# EAGLE board radiva3 (EAGLE 7.7.0)
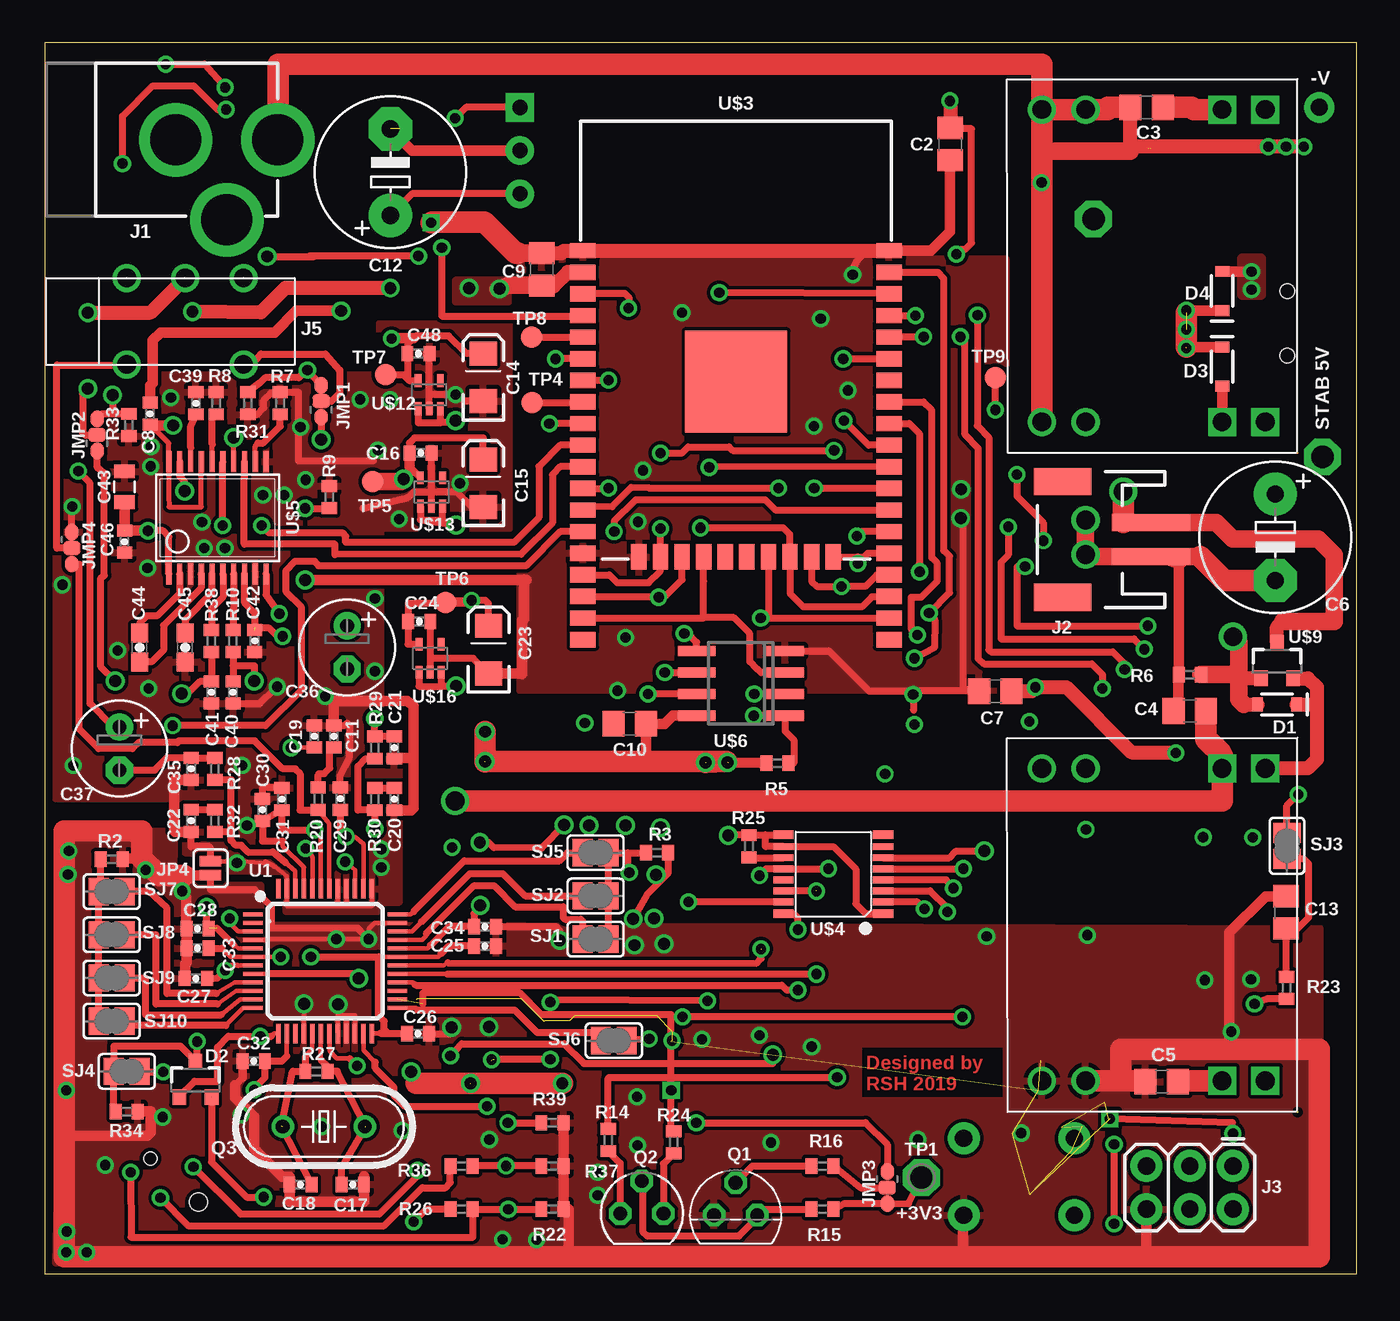
[diagram p2: board, top side]
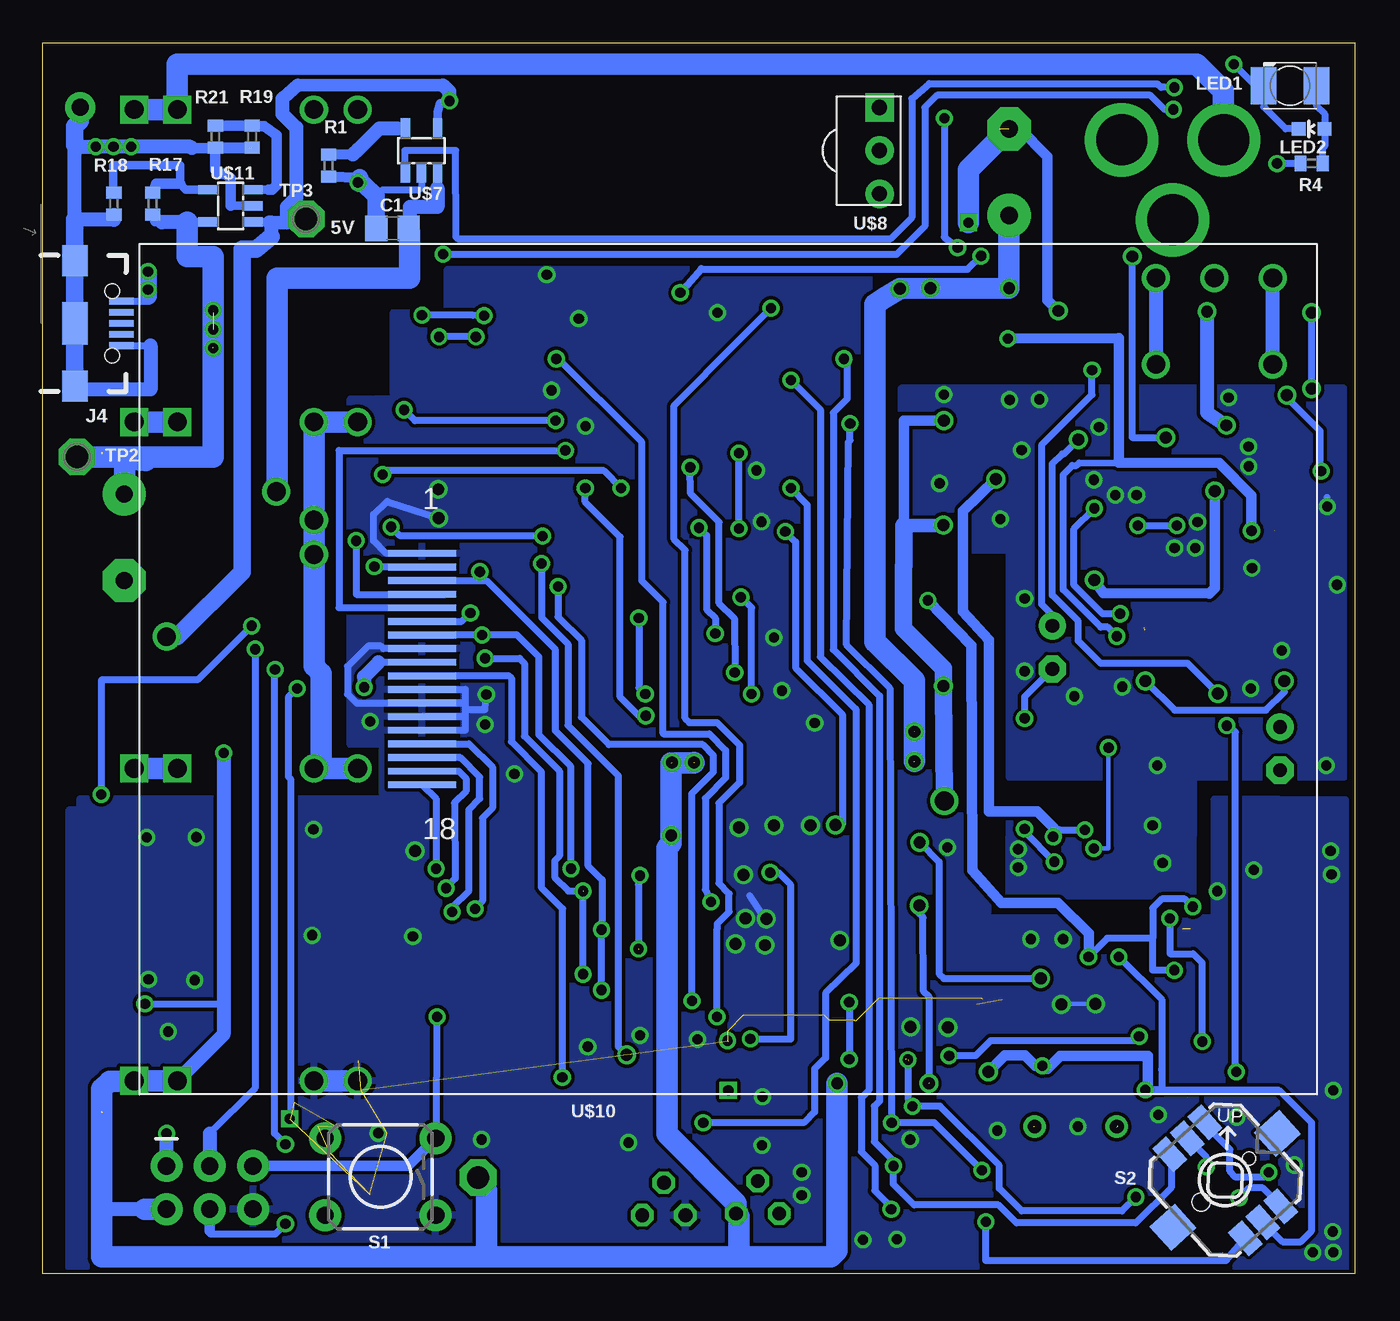
[diagram p3: board, bottom side, seen from below]

Size 77.14 x 72.38 mm. Coordinates in mm from the lower left corner, seen from the top.
Outline: 0,0 77.14,0 77.14,72.38 0,72.38 0,0
Copper layers (1*16): Top 0.035mm / dielectric 1.5mm / Bottom 0.035mm
Design rules "default *": minimum track width 10mil, minimum drill 23mil, track to track 8mil, track to pad 9mil, pad to pad 8mil, via to via 8mil, smd to smd 8mil, copper to edge 10mil, drill to drill 8mil, minimum pad ring 10mil, minimum via ring 8mil, stop-mask expansion 4mil, vias tented up to drill 0mil, thermal gap 10mil
tRestrict: area 48.1,10.4 to 56.3,13.3

## Footprints (pad centres in the part's own frame; a part is rotated, then mirrored left to right if it is on the bottom)
C0805 = smd 1.3 x 1.5: 1 -0.95,0; 2 0.95,0
E5-8,5 = drill 1.016 pad 2.54: + -2.54,0 | drill 1.016 pad 2.54 octagon: - 2.54,0
0402-CAP = smd 0.7 x 0.9: 1 -0.65,0; 2 0.65,0
EIA3216 = smd 1.4 x 1.6: A 1.4,0; C -1.4,0
E2,5-6 = drill 0.813 pad 1.6: + -1.27,0 | drill 0.813 pad 1.6 octagon: - 1.27,0
0805 = smd 0.8 x 1.2: 1 -0.9,0; 2 0.9,0
0603-CAP = smd 1.1 x 1: 1 -0.85,0; 2 0.85,0
SOD-323 = smd 0.63 x 0.83: A 1.15,0; C -1.15,0
SOT23-3 = smd 0.8 x 0.9: 1 -0.95,-1; 2 0.95,-1; 3 0,1.1
POWER_JACK_PTH = drill 2.997 pad 4.318: GND 0,7.7; GNDBREAK 4.7,10.7; PWR 0,13.7
JST-2-SMD = smd 1 x 4.6: 1 -1,-3.7; 2 1,-3.7 | smd 1.6 x 3.4: NC1 -3.4,1.5; NC2 3.4,1.5
2X3 = drill 1.016 pad 1.88: 1 0,0; 2 0,2.54; 3 2.54,0; 4 2.54,2.54; 5 5.08,0; 6 5.08,2.54
USB-B-MICRO-SMD = smd 1.45 x 0.4: D+ 2.725,0; D- 2.725,0.65; GND 2.725,-1.3; ID 2.725,-0.65; VBUS 2.725,1.3 | smd 1.5 x 1.8: SHIELD1 0,3.685; SHIELD2 0,-3.685 | smd 1.5 x 2.5: SHIELD3 0,0 | hole 0.85: 2.2,1.9; 2.2,-1.9
AUDIO-JACK = drill 1.1: P$1 0,0; P$2 0,-3.429; P$3 0,-6.858; P$4 5.08,-6.858; P$5 5.08,0
C0R-JMP = smd 0.8 x 1: 1 0,0.938; 3 0,-0.938 | smd 1 x 0.8: 2 0,0
SJ_2S = smd 0.635 x 1.27: 1 -0.412,0; 2 0.412,0
KA-3528ASYC = smd 1.5 x 2.2: A -1.55,0; C 1.55,0
LED-0603 = smd 0.8 x 0.8: A 0,-0.75; C 0,0.75
TO92 = drill 0.813 octagon: 1 1.27,0; 2 0,1.905; 3 -1.27,0
SOT54E = drill 0.813 octagon: D -1.27,0; G 0,1.905; S 1.27,0
HC49U = drill 0.813: 1 -2.413,0; 2 2.413,0
R0402 = smd 0.7 x 0.9: 1 -0.65,0; 2 0.65,0
TACTILE_SWITCH_PTH_6.0MM = drill 1.016 pad 1.88: 1 -3.251,2.261; 2 3.251,2.261; 3 -3.251,-2.261; 4 3.251,-2.261
JOYSTICK_MINI = smd 1.85 x 1.1: A -3.325,1.4; B 3.325,1.4; C -3.325,-1.4; CTR -3.325,0; D 3.325,-1.4; GND 3.325,0 | smd 1.9 x 2: NC 0,4.13; NC@0 0,-4.13 | hole 0.75: 0,1.9 | hole 1.05: 0,-1.9
SJ = smd 1.168 x 1.6: 1 -0.762,0; 2 0.762,0
P1-13 = drill 1.321 pad 2.159 octagon: TP 0,0
B1,27 = smd 1.27 x 1.27: TP 0,0
LQFP-48 = smd 0.254 x 1.143: 1 -2.75,-4.25; 2 -2.25,-4.25; 3 -1.75,-4.25; 4 -1.25,-4.25; 5 -0.75,-4.25; 6 -0.25,-4.25; 7 0.25,-4.25; 8 0.75,-4.25; 9 1.25,-4.25; 10 1.75,-4.25; 11 2.25,-4.25; 12 2.75,-4.25; 25 2.75,4.25; 26 2.25,4.25; 27 1.75,4.25; 28 1.25,4.25; 29 0.75,4.25; 30 0.25,4.25; 31 -0.25,4.25; 32 -0.75,4.25; 33 -1.25,4.25; 34 -1.75,4.25; 35 -2.25,4.25; 36 -2.75,4.25 | smd 1.143 x 0.254: 13 4.25,-2.75; 14 4.25,-2.25; 15 4.25,-1.75; 16 4.25,-1.25; 17 4.25,-0.75; 18 4.25,-0.25; 19 4.25,0.25; 20 4.25,0.75; 21 4.25,1.25; 22 4.25,1.75; 23 4.25,2.25; 24 4.25,2.75; 37 -4.25,2.75; 38 -4.25,2.25; 39 -4.25,1.75; 40 -4.25,1.25; 41 -4.25,0.75; 42 -4.25,0.25; 43 -4.25,-0.25; 44 -4.25,-0.75; 45 -4.25,-1.25; 46 -4.25,-1.75; 47 -4.25,-2.25; 48 -4.25,-2.75
ESP-WROOM-WROOVER-32 = smd 0.9 x 1.5: 1 7.7,9; 2 6.43,9; 3 5.16,9; 4 3.89,9; 5 2.62,9; 6 1.35,9; 7 0.08,9; 8 -1.19,9; 9 -2.46,9; 10 -3.73,9; 11 -5,9; 12 -6.27,9; 13 -7.54,9; 14 -8.81,9; 25 -8.81,-9; 26 -7.54,-9; 27 -6.27,-9; 28 -5,-9; 29 -3.73,-9; 30 -2.46,-9; 31 -1.19,-9; 32 0.08,-9; 33 1.35,-9; 34 2.62,-9; 35 3.89,-9; 36 5.16,-9; 37 6.43,-9; 38 7.7,-9; 39 -10.08,9; 40 -11.35,9; 41 -12.62,9; 42 -13.89,9; 43 -15.16,9; 44 -15.16,-9; 45 -13.89,-9; 46 -12.62,-9; 47 -11.35,-9; 48 -10.08,-9 | smd 1.5 x 0.9: 15 -10.3,5.715; 16 -10.3,4.445; 17 -10.3,3.175; 18 -10.3,1.905; 19 -10.3,0.635; 20 -10.3,-0.635; 21 -10.3,-1.905; 22 -10.3,-3.175; 23 -10.3,-4.445; 24 -10.3,-5.715 | smd 6 x 6: GND 0,0
TSSOP16-0.65-5X4.4MM = smd 0.5 x 1.2: 1 -2.325,-2.925; 8 2.325,-2.925; 9 2.325,2.925; 16 -2.325,2.925 | smd 0.4 x 1.2: 2 -1.625,-2.925; 3 -0.975,-2.925; 4 -0.325,-2.925; 5 0.325,-2.925; 6 0.975,-2.925; 7 1.625,-2.925; 10 1.625,2.925; 11 0.975,2.925; 12 0.325,2.925; 13 -0.325,2.925; 14 -0.975,2.925; 15 -1.625,2.925
SSOP20 = smd 0.305 x 1.245: 1 -2.857,-3.302; 2 -2.222,-3.302; 3 -1.587,-3.302; 4 -0.952,-3.302; 5 -0.317,-3.302; 6 0.318,-3.302; 7 0.953,-3.302; 8 1.588,-3.302; 9 2.223,-3.302; 10 2.858,-3.302; 11 2.858,3.302; 12 2.223,3.302; 13 1.588,3.302; 14 0.953,3.302; 15 0.318,3.302; 16 -0.317,3.302; 17 -0.952,3.302; 18 -1.587,3.302; 19 -2.222,3.302; 20 -2.857,3.302
SO-08 = smd 0.6 x 2.2: 1 -1.905,-2.6; 2 -0.635,-2.6; 3 0.635,-2.6; 4 1.905,-2.6; 5 1.905,2.6; 6 0.635,2.6; 7 -0.635,2.6; 8 -1.905,2.6
SOT23-5 = smd 0.55 x 1.2: 1 -0.95,-1.3; 2 0,-1.3; 3 0.95,-1.3; 4 0.95,1.3; 5 -0.95,1.3
IR = drill 0.9 pad 1.676 square: P$1 -2.54,0 | drill 0.9 pad 1.676: P$2 0,0; P$3 2.54,0
TFT-DISPLAY-2.8 = smd 4 x 0.4: P$1 -18,6.8; P$2 -18,6; P$3 -18,5.2; P$4 -18,4.4; P$5 -18,3.6; P$6 -18,2.8; P$7 -18,2; P$8 -18,1.2; P$9 -18,0.4; P$10 -18,-0.4; P$11 -18,-1.2; P$12 -18,-2; P$13 -18,-2.8; P$14 -18,-3.6; P$15 -18,-4.4; P$16 -18,-5.2; P$17 -18,-6; P$18 -18,-6.8
SC70 = smd 0.4 x 0.75: 1 -0.65,-0.825; 2 0,-0.825; 3 0.65,-0.825; 4 0.65,0.825; 5 -0.65,0.825
DC-DC_PT1584 = drill 1.1 square: P$1 1.905,-20.193; P$4 1.905,-1.829; P$5 4.445,-20.193; P$8 4.445,-1.829 | drill 1.1: P$2 15.037,-20.193; P$3 15.037,-1.829; P$6 12.471,-20.193; P$7 12.471,-1.829

## Placement (x,y rotation side)
C1  10uF  [C0805]  56.57,61.47 0 bottom
C2  10uF  [C0805]  53.21,66.42 270 top
C3  10uF  [C0805]  64.77,68.58 0 top
C4  10uF  [C0805]  67.31,33.1 0 top
C5  10uF  [C0805]  65.66,11.3 0 top
C6  680uF  [E5-8,5]  72.34,43.31 270 top
C7  10uF  [C0805]  55.88,34.26 0 top
C8  100nF  [0402-CAP]  6.2,50.57 90 top
C9  10uF  [C0805]  29.21,59.05 90 top
C10  10uF  [C0805]  34.39,32.33 180 top
C11  47nF  [0402-CAP]  16.99,31.6 90 top
C12  100uF  [E5-8,5]  20.32,64.77 90 top
C13  10uF  [C0805]  72.97,21.26 270 top
C14  10uF  [EIA3216]  25.78,52.7 90 top
C15  10uF  [EIA3216]  25.78,46.48 90 top
C16  0.1uF  [0402-CAP]  22.1,48.26 0 top
C17  18pF  [0402-CAP]  18.11,5.26 180 top
C18  18pF  [0402-CAP]  15.04,5.26 0 top
C19  0.1uF  [0402-CAP]  15.85,31.6 270 top
C20  10nF  [0402-CAP]  20.55,27.91 270 top
C21  3.3nF  [0402-CAP]  20.55,30.94 270 top
C22  10nF  [0402-CAP]  8.61,26.64 270 top
C23  10uF  [EIA3216]  26.09,36.7 90 top
C24  0.1uF  [0402-CAP]  22.02,38.35 0 top
C25  100nF  [0402-CAP]  25.88,19.28 0 top
C26  100nF  [0402-CAP]  21.95,14.12 0 top
C27  100nF  [0402-CAP]  8.89,17.37 180 top
C28  100nF  [0402-CAP]  8.99,20.29 180 top
C29  100nF  [0402-CAP]  17.37,27.94 90 top
C30  100nF  [0402-CAP]  12.8,27.28 90 top
C31  100nF  [0402-CAP]  13.94,27.91 90 top
C32  100nF  [0402-CAP]  12.29,12.52 180 top
C33  100nF  [0402-CAP]  8.99,19.15 180 top
C34  100nF  [0402-CAP]  25.88,20.42 0 top
C35  3.3nF  [0402-CAP]  8.61,29.69 270 top
C36  220uF  [E2,5-6]  17.78,36.83 270 top
C37  220uF  [E2,5-6]  4.39,30.89 270 top
C39  100nF  [0402-CAP]  8.89,51.18 90 top
C40  2.2nF  [0402-CAP]  11.07,34.19 270 top
C41  2.2nF  [0402-CAP]  9.8,34.19 270 top
C42  100nF  [0402-CAP]  12.34,37.21 270 top
C43  22uF  [0805]  4.7,46.28 90 top
C44  2.2uF  [0603-CAP]  5.59,36.83 90 top
C45  2.2uF  [0603-CAP]  8.26,36.83 90 top
C46  100nF  [0402-CAP]  4.7,43.05 90 top
C48  0.1uF  [0402-CAP]  21.97,54.1 0 top
D1  3A/10V/280mV  [SOD-323]  72.44,33.48 180 top
D2  200mA/70V  [SOT23-3]  8.86,11.4 0 top
D3  3A/10V/280mV  [SOD-323]  69.22,53.34 270 top
D4  3A/10V/280mV  [SOD-323]  69.22,57.78 90 top
J1  POWER_JACK  [POWER_JACK_PTH]  0,66.67 270 top
J2  [JST-2-SMD]  61.34,43.18 90 top
J3  [2X3]  69.85,6.35 180 top
J4  [USB-B-MICRO-SMD]  75.23,55.88 0 bottom
J5  AUDIO-JACK  [AUDIO-JACK]  11.68,58.55 270 top
JMP1  0R-JUMPC  [C0R-JMP]  16.26,51.31 180 top
JMP2  0R-JUMPC  [C0R-JMP]  3.07,49.33 180 top
JMP3  0R-JUMPC  [C0R-JMP]  49.53,5.08 0 top
JMP4  0R-JUMPC  [C0R-JMP]  1.6,42.67 0 top
JP4  [SJ_2S]  9.75,23.85 90 top
LED1  3528  [KA-3528ASYC]  3.81,69.85 180 bottom
LED2  0603  [LED-0603]  2.54,67.31 90 bottom
Q1  2N3904  [TO92]  40.61,3.45 0 top
Q2  BS250  [SOT54E]  35.1,3.56 0 top
Q3  12.288MHz  [HC49U]  16.41,8.66 0 top
R1  1.1k  [R0402]  60.33,65.15 90 bottom
R2  100k  [R0402]  3.94,24.38 180 top
R3  100k  [R0402]  35.99,24.77 180 top
R4  2k  [R0402]  2.54,65.28 180 bottom
R5  10k  [R0402]  43.08,30.02 0 top
R6  10k  [R0402]  67.31,35.23 180 top
R7  10k  [R0402]  13.84,51.18 90 top
R8  10k  [R0402]  10.08,51.18 90 top
R9  10k  [R0402]  16.74,45.67 270 top
R10  470  [R0402]  11.07,37.21 90 top
R14  10  [R0402]  33.12,7.87 90 top
R15  10k  [R0402]  45.72,3.81 180 top
R16  1k  [R0402]  45.72,6.35 180 top
R17  100k  [R0402]  70.66,62.92 90 bottom
R18  100k  [R0402]  72.95,62.92 270 bottom
R19  6.8k  [R0402]  64.82,66.85 90 bottom
R20  10  [R0402]  16.08,27.94 270 top
R21  6.8k  [R0402]  66.98,66.85 90 bottom
R22  10k  [R0402]  29.84,3.81 0 top
R23  10k  [R0402]  73,16.81 90 top
R24  100k  [R0402]  36.98,7.75 270 top
R25  10k  [R0402]  41.4,25.15 270 top
R26  10k  [R0402]  24.51,3.81 0 top
R27  1M  [R0402]  15.98,11.91 0 top
R28  470  [R0402]  10.01,29.69 270 top
R29  470  [R0402]  19.41,30.94 270 top
R30  20  [R0402]  19.41,27.91 270 top
R31  47k  [R0402]  11.94,51.18 270 top
R32  20  [R0402]  10.01,26.64 270 top
R33  47k  [R0402]  4.95,49.91 90 top
R34  1k  [R0402]  4.83,9.55 180 top
R36  10k  [R0402]  24.51,6.35 0 top
R37  10k  [R0402]  29.84,6.35 180 top
R38  470  [R0402]  9.8,37.21 90 top
R39  10k  [R0402]  29.84,8.89 0 top
S1  MOMENTARY-SWITCH-SPST-PTH-6.0MM  [TACTILE_SWITCH_PTH_6.0MM]  57.28,5.71 180 bottom
S2  [JOYSTICK_MINI]  7.62,5.51 312 bottom
SJ1  [SJ]  32.38,19.68 0 top
SJ2  [SJ]  32.38,22.23 0 top
SJ3  [SJ]  73.03,25.17 270 top
SJ4  [SJ]  4.83,11.91 180 top
SJ5  [SJ]  32.38,24.77 0 top
SJ6  [SJ]  33.45,13.72 0 top
SJ7  [SJ]  3.94,22.48 0 top
SJ8  [SJ]  3.94,19.94 0 top
SJ9  [SJ]  3.94,17.4 0 top
SJ10  [SJ]  3.94,14.86 0 top
TP1  PTR1PAD1-13  [P1-13]  51.54,5.66 0 top
TP2  PTR1PAD1-13  [P1-13]  75.11,48.03 90 bottom
TP3  PTR1PAD1-13  [P1-13]  61.65,62.03 0 bottom
TP4  PTR1B1,27  [B1,27]  28.65,51.23 180 top
TP5  PTR1B1,27  [B1,27]  19.28,46.58 0 top
TP6  PTR1B1,27  [B1,27]  23.57,39.47 0 top
TP7  PTR1B1,27  [B1,27]  20.04,52.86 0 top
TP8  PTR1B1,27  [B1,27]  28.63,55.07 180 top
TP9  PTR1B1,27  [B1,27]  55.88,52.7 0 top
U1  VS1053B  [LQFP-48]  16.48,18.39 270 top
U$3  ESP-WROOM-WROOVER-32  [ESP-WROOM-WROOVER-32]  40.64,52.45 90 top
U$4  XPT2046  [TSSOP16-0.65-5X4.4MM]  46.35,23.5 90 top
U$5  PCM510X  [SSOP20]  10.16,44.45 0 top
U$6  IPS6404L-SQ-SPN  [SO-08]  40.92,34.72 90 top
U$7  TP4054  [SOT23-5]  54.86,66.04 0 bottom
U$8  VS1838  [IR]  27.94,66.04 270 bottom
U$9  CJ2301  [SOT23-3]  72.44,36.02 0 top
U$10  TFT-DISPLAY-2.8  [TFT-DISPLAY-2.8]  36.83,35.56 0 bottom
U$11  SY6280  [SOT23-5]  66.09,62.79 90 bottom
U$12  3.2  [SC70]  22.61,51.69 0 top
U$13  2.8  [SC70]  22.73,45.97 0 top
U$14  3.3V 2A  [DC-DC_PT1584]  73.66,9.53 180 top
U$15  5V 2A  [DC-DC_PT1584]  73.66,48.26 180 top
U$16  1.8  [SC70]  22.66,36.2 0 top

## Tracks (layer width: path | path; a pad name or v marks a point on that pad's centre or on a via)
0  (via drill 0.6)
  Top 0.406: U$3.25 48.01,43.64 v47.75,43.38 | v56.64,43.92 56.64,42.27 56.21,41.83 56.21,37.34 64.03,37.34 v64.64,36.73
  Bottom 0.406: v47.75,43.38 56.11,43.38 v56.64,43.92 | v64.64,36.73 64.64,10.92 67.31,8.26
  Bottom 0.813: 67.31,8.26 J3.3
2  (via drill 0.6, 0.7)
  Top 0.254: 13.34,13.97 13.51,14.14 U1.13 13.49,14.15 13.31,13.97 v12.68,13.97
  Top 0.406: U$3.48 48.39,42.37 48.17,42.15 U$3.24 47.8,42.15 v47.8,41.76 | D2.1 7.92,10.43 8.81,11.33 10.16,11.33 10.16,13.34 10.79,13.97 v12.68,13.97 13.34,13.97 | v23.85,12.83 24.51,13.54 30.53,13.54 31.7,12.37 42.8,12.37 v42.8,12.88
  Bottom 0.406: v47.8,41.76 47.8,38.58 46.25,37.03 46.25,32.26 43.28,29.29 43.28,13.36 v42.8,12.88 | v12.68,13.97 12.93,13.72 21.41,13.72 22.3,12.83 v23.85,12.83
4  (via drill 0.6, 0.7)
  Top 0.254: 13.16,17.63 13.14,17.64 U1.8
  Top 0.406: 30.56,26.39 v30.53,26.39 29.21,25.04 26.39,25.07 26.09,25.38 v25.58,25.38 | v18.47,17.37 18.21,17.63 13.16,17.63 | v33.48,43.64 33.48,44.25 34.75,45.52 42.34,45.52 42.95,44.91 U$3.26
  Bottom 0.406: v25.58,25.38 24.43,24.23 24.43,17.65 24.16,17.37 v18.47,17.37 | v33.48,43.64 32.87,43.03 32.87,35.64 30.12,32.89 30.12,26.42 30.15,26.39 v30.53,26.39
5  (via drill 0.6)
  Top 0.406: U$3.29 48.43,48.72 v46.99,50.16 | v55.88,50.8 TP9.TP
  Bottom 0.406: v46.99,50.16 55.24,50.16 v55.88,50.8
5V  (via drill 0.6, 1.1)
  Top 0.406: v4.57,65.28 4.57,68.07 6.35,69.85 8.76,69.85 10.16,68.45 v10.67,68.45 | C2.1 53.27,67.31 54.48,67.31 54.48,60.6 54.1,60.22 53.87,60.22 v53.59,59.94
  Top 0.813: 53.27,67.31 53.27,68.9 v53.21,68.96 | 70.48,33.48 D1.A | U$9.1 70.25,35.02 70.18,34.95
  Top 1.016: v69.85,37.47 69.88,37.47 70.18,37.16 70.18,35.56 | 70.18,35.56 70.18,34.95 70.18,33.78 70.48,33.48 | R6.1 69.85,35.23 70.18,35.56
  Bottom 0.406: R4.2 v4.57,65.28 | v10.67,68.45 11.18,68.45 12.01,69.29 24.56,69.29 25.27,68.58 25.27,61.59 26.92,59.94 v53.59,59.94
  Bottom 0.508: U$7.4 53.91,68.16 53.92,68.17 53.92,68.3 53.77,68.83 53.34,68.83 v53.21,68.96 | 63.8,61.82 63.82,61.84 U$11.1 63.72,61.84 63.7,61.82
  Bottom 0.762: 62.97,69.14 62.13,69.9 53.59,69.88
  Bottom 0.813: 63.8,61.82 63.78,61.82 62.78,61.81 | 62.78,61.81 62.61,61.98 | 53.59,69.88 53.24,69.52 53.24,68.99 v53.21,68.96 | TP3.TP 62.53,62.03 62.78,61.81 | 62.97,69.14 63.04,69.06 63.04,68.2 62.23,67.39 62.23,63.27 62.78,62.73 62.78,61.81 | 63.7,61.82 63.7,60.98
  Bottom 1.016: 63.7,60.98 64.59,60.25 65.41,60.25 65.41,41.27 69.22,37.47 v69.85,37.47
12  (via drill 0.6)
  Top 0.406: SJ4.1 5.61,11.89 v6.96,11.89 | U$3.14 30.31,43.64 28.3,41.63 16.08,41.63 16.08,41.68 15.88,41.88 14.71,41.88 14.17,41.33 14.17,40.13 15.06,39.24 15.06,34.29 12.98,32.23 v7.52,32.23
  Bottom 0.406: v6.96,11.89 7.01,11.94 7.01,31.85 7.39,32.23 v7.52,32.23
13  (via drill 0.6)
  Top 0.406: U$3.40 33.19,41.1 33.66,40.64 35.51,40.64 36.2,41.33 U$3.16 v36.2,43.81 | v36.2,48.26 37.47,48.26 37.82,48.62 40.23,48.62 40.44,48.41 v46.41,48.41
  Bottom 0.406: U$10.P$5 59.72,39.16 59.72,48.41 v46.41,48.41 | v36.2,43.81 v36.2,48.26
14  (via drill 0.6)
  Top 0.406: v43.13,46.2 35.51,46.21 34.47,46.23 33.35,45.11 31.81,45.09 U$3.13 | v57.15,46.99 57.15,45.72 58.7,44.17 v58.7,43.1
  Bottom 0.305: 53.44,39.95 53.47,39.93 54.8,39.93 U$10.P$4
  Bottom 0.406: v58.7,43.1 58.7,39.95 53.44,39.95 | v43.13,46.2 44.15,47.22 57.15,47.22 v57.15,46.99
15  (via drill 0.6)  (3 unrouted)
  Top 0.254: 19.43,12.45 18.73,13.14 U1.23
  Top 0.406: U$3.23 45.09,40.72 45.39,40.41 v46.84,40.41 48.23,40.41 48.92,41.1 U$3.47 | 19.43,12.45 19.43,12.09 20.52,11 20.52,10.52 21.16,9.86 v26.01,9.86 | v38.96,16.05 29.74,16.1 v29.72,15.98 | v29.72,12.62 26.42,12.62 | 9.75,10.46 9.8,10.41 9.8,6.58 11.86,4.52 v12.88,4.52
  Bottom 0.406: v46.84,40.41 46.84,38.63 45.47,37.26 45.47,32.74 43.84,31.11 38.33,31.11 37.72,30.5 37.72,29.49 38.99,28.22 38.99,16.08 v38.96,16.05 38.99,16.1 | v29.72,15.98 v29.72,12.62 | 26.36,12.62 26.24,12.52 26.24,10.24 26.01,9.88 v26.01,9.86 24.38,9.86 20.9,6.38 20.9,5.03 19.58,3.71 13.69,3.71 v12.88,4.52
  other vias: 26.26,12.6
16  (via drill 0.6)
  Top 0.406: v41.68,32.82 U$6.1 43.52,31.92 44.04,31.39 44.04,30.04 R5.2 | v45.24,46.2 49.62,46.2 U$3.27
  Bottom 0.406: v41.68,32.82 41.71,32.84 42.11,32.84 43.18,33.91 43.18,43.33 45.24,45.39 v45.24,46.2
17  (via drill 0.6)
  Top 0.406: U$3.28 39.12,47.43 v39.06,47.42 | v36.45,35.36 U$6.6
  Bottom 0.406: v36.45,35.36 36.47,38.53 37.36,39.42 37.36,44.2 39.04,45.87 v39.06,47.42
18  (via drill 0.6)
  Top 0.254: U1.28 21.65,17.14 21.77,17.02
  Top 0.406: 43.43,21.16 U$4.16 43.47,21.13 44.07,21.13 44.27,20.93 v44.27,20.24 | U$3.30 50.82,49.99 51.41,49.4 51.41,41.76 v51.44,41.27 | 21.77,17.02 21.82,16.97 43.33,16.97 43.61,16.69 v44.27,16.69
  Bottom 0.406: v44.27,16.69 v44.27,20.24 44.25,20.27 44.25,23.16 45.06,23.98 45.06,30 46.99,31.93 46.99,36.7 51.05,40.76 51.44,40.76 | U$10.P$3 51.44,40.76 | v51.44,41.27 51.44,40.76
19  (via drill 0.6)  (1 unrouted)
  Top 0.254: U1.30 23.45,18.14 23.7,18.29
  Top 0.406: U$3.31 51.66,51.26 52.15,50.77 52.15,42.11 52.48,41.78 52.48,40.74 51.51,39.78 50.93,39.78 50.93,37.92 v51.31,37.57 | v46.08,23.82 v46.07,23.82 U$4.12 42.41,23.82 v42.01,23.42 | 23.7,18.29 41.83,18.26 42.11,18.54 v42.11,19.1
  Bottom 0.406: U$10.P$7 v51.31,37.57 49.25,37.57 47.95,36.27 47.95,31.7 46.08,29.82 v46.08,23.82 | v42.01,23.42 42.01,23.39 42.11,22.89 42.11,19.07
21  (via drill 0.6)
  Top 0.406: U$4.15 v37.85,21.87 | v46.94,53.8 U$3.33
  Bottom 0.406: 37.87,21.87 v37.85,21.87 38.15,22.58 38.18,22.61 38.18,27.96 36.98,29.16 36.98,30.79 37.95,31.75 40.64,31.75 40.66,31.77 40.66,39.5 41.91,40.74 41.91,48.9 46.94,53.92 v46.94,53.8
22  (via drill 0.6, 0.7)
  Top 0.305: U$5.14 11.11,48.7 11.1,48.72
  Top 0.406: U$3.36 49.62,57.63 v39.65,57.68 | v21.97,59.84 15.88,59.84 | 15.88,59.84 15.57,59.84 15.54,59.82 | 11.1,48.72 v11.1,49.17 | v13.08,59.82 15.85,59.82 15.88,59.84
  Bottom 0.406: v39.65,57.68 38.41,59.11 38.35,59.05 22.76,59.05 v21.97,59.84 | 11.1,49.12 v11.1,49.17 13.08,49.17 v13.08,59.82
23  (via drill 0.6)  (1 unrouted)
  Top 0.254: U1.29 21.38,17.64 23.67,17.63
  Top 0.406: 45.34,22.5 43.45,22.5 U$4.14 | U$3.37 52.5,58.88 52.86,58.52 52.86,42.52 53.19,42.19 53.19,40.06 v51.99,38.86 52.32,38.46 52.3,36.8 v51.13,36.2 | 23.67,17.63 v45.36,17.63
  Bottom 0.406: v45.36,17.63 v45.36,22.5 46.23,22.5 47.04,23.32 47.04,24.28 46.76,24.56 46.76,29.57 48.82,31.62 48.82,35.89 49.1,36.2 v51.13,36.2 | U$10.P$6 52.5,38.36 v51.99,38.86
25  (via drill 0.6)
  Top 0.406: U$3.10 30.31,48.72 29.06,47.47 29.06,44.48 27.58,43 17.7,43 17.7,43.36 17.5,43.56 13.18,43.56 v12.75,43.99 | v10.46,43.99 10.46,47.74 U$5.15
  Bottom 0.406: v12.75,43.99 v10.46,43.99
26
  Top 0.406: U$3.11 30.31,47.45 29.84,46.99 29.84,44.15 28.02,42.32 17.07,42.29 17.07,42.9 11.73,42.9 11.73,46.81 11.75,46.81 U$5.13
27  (via drill 0.6)
  Top 0.406: U$3.12 33.15,46.18 v33.15,46.2 | v38.3,8.89 48.26,8.89 49.53,7.62 JMP3.1
  Bottom 0.406: v38.3,8.89 32.38,8.89 31.75,9.53 31.75,12.06 31.11,12.7 31.11,16.51 29.31,18.26 29.34,33.22 29.36,33.22 32.18,36.04 32.18,45.21 v33.15,46.2
32
  Top 0.406: TP4.TP 31.61,51.23 U$3.8
33  (via drill 0.6)
  Top 0.406: v8.74,6.3 11.51,3.53 19.68,3.53 21.92,5.77 v21.92,6.1 | v27.23,8.89 R39.1 | U$3.9 v29.67,49.99
  Bottom 0.406: S2.CTR 8.74,6.88 v8.74,6.3 | v21.92,6.1 24.71,8.89 v27.23,8.89 27.33,34.44 29.87,36.98 29.77,48.9 29.67,49 v29.67,49.99
34  (via drill 0.6)
  Top 0.406: R36.2 v27.13,6.35 R37.2 | U$3.6 v30.02,53.8
  Bottom 0.406: S2.C 10.88,6.97 10.79,6.88 10.79,5.08 12.88,3 19.89,3 20.95,4.06 25.91,4.06 27.13,5.28 v27.13,6.35 27.13,6.66 28.25,7.77 28.25,9.86 27.94,10.16 27.94,33.98 30.66,36.7 30.66,50.62 29.84,51.44 29.84,53.62 v30.02,53.8
35  (via drill 0.6)
  Top 0.406: v5.05,5.97 5.08,2.16 25.17,2.16 R26.2 | R26.2 | U$3.7 31.66,52.55 v33.15,52.55 | R22.1 v27.25,3.81 R26.2
  Bottom 0.406: v5.05,5.97 5.33,5.69 7.01,5.69 7.34,6.04 7.34,7.32 8.8,8.8 S2.A | v33.15,52.55 31.42,50.83 31.42,36.27 28.57,33.48 28.57,10.79 29.01,10.36 29.01,7.19 28.22,6.4 28.22,4.9 27.25,3.94 v27.25,3.81
36  (via drill 0.6)
  Top 0.406: U$8.P$1 24.77,68.58 v24.13,67.94 | U$3.4 31.61,56.31 23.34,56.31 v23.34,60.33
  Bottom 0.406: v24.13,67.94 24.13,60.96 v23.34,60.33
39
  Top 0.406: TP8.TP U$3.5
+3V3  (via drill 0.6, 0.7)  (5 unrouted)
  Top 0.254: 10.41,19.15 10.92,18.64 11.23,18.64 U1.6 v13.87,18.64 | 14.22,12.8 14.22,14.13 U1.14 | U1.19 16.74,13.11 17.17,12.68 17.93,12.68 | U1.32 21.55,19.14 21.57,19.15 22.5,19.15 22.68,19.33
  Top 0.305: U$5.17 9.21,45.09 7.32,45.09 7.3,45.73 U$5.20 7.3,48.83 6.48,49.66
  Top 0.406: C33.1 10.41,19.15 | v12.32,10.82 12.19,10.79 12.95,11.56 12.95,12.51 C32.1 13.95,12.52 14.22,12.8 | 17.93,12.68 v18.36,12.24 | v25.6,21.67 25.32,21.29 25.23,21.19 C34.1 23.77,20.42 22.68,19.33 | 21.84,11.2 21.87,11.23 25.04,11.23 | 42.37,25.82 41.43,25.82 R25.1 40.28,25.81 v40.18,25.78 | 42.37,25.82 U$4.9 | 42.37,25.82 42.37,25.15 42.39,25.12 U$4.10 46.35,25.12 47.68,23.8 47.68,21.77 48.28,21.16 48.31,21.16 48.32,21.17 U$4.1 | R24.2 36.37,6.49 Q2.S | R15.1 47,4.14 JMP3.3 50.78,4.14 TP1.TP | U$8.P$3 21.59,63.5 C12.+ | R23.1 71.82,16.17 v71.12,15.88 | 6.48,49.66 C8.1 | 27.3,58.12 C9.1
  Top 0.61: 21.84,11.2 21.54,11.51 v21.54,11.89 | R5.1 42.1,30.05 v38.84,30.07 | 34.92,30.12 35.34,30.54 C10.1 36.45,32.33 36.93,32.82 U$6.8 | v7.54,49.89 6.49,49.89 C8.1
  Top 0.813: U$3.2 31.64,58.9 30.76,58.9 29.92,58.06 29.25,58.06 C9.1 | v66.5,30.63 66.47,30.66 63.88,30.66 60.05,34.49 v58.24,34.49 58.01,34.27 C7.2 | v20.32,57.96 14.15,57.96 12.7,56.52 v8.69,56.57
  Top 1.016: 26.64,57.89 27.3,58.12 29.34,58.12
  Top 1.27: U$14.P$8 66.66,11.35 C5.2 | v30.43,11.2 v25.04,11.2 21.84,11.2 | v38.84,30.07 40.08,30.12 34.92,30.12 v25.88,30.12 | 29.34,58.12 C9.1 | 25.89,31.9 25.89,30.11
  Bottom 0.254: v18.36,12.24 18.19,12.06 | 11.43,12.06 11.35,11.99
  Bottom 0.406: S2.GND 4.26,1.91 3.17,1.91 2.54,2.54 2.54,8.89 4.45,10.79 11.33,10.82 | 11.33,10.82 v12.32,10.82 | v13.87,18.64 11.35,16.13 11.35,11.99 11.35,10.84 11.33,10.82 | 25.02,11.2 25.02,16.28 25.35,16.61 25.38,20.95 25.6,21.18 v25.6,21.67 | 40.44,25.04 40.34,25.17 40.18,25.32 | U$10.P$9 57.38,35.96 | v71.12,15.88 66.5,15.88 | 26.36,58.12 v26.75,57.91 26.04,57.78 26.06,57.78 26.75,57.89
  Bottom 0.61: v21.54,11.89 20.57,12.85 19.38,12.85 18.77,12.24 v18.36,12.24 | Q2.S 36.2,3.38 | 18.19,12.06 18.06,12.06 17.3,12.83 12.17,12.83 12.17,10.97 v12.32,10.82
  Bottom 0.813: 71.78,11.33 U$14.P$4 | 71.12,3.81 73.66,3.81 | 57.38,35.96 58.24,35.1 v58.24,34.49 | v66.5,30.63 66.5,15.88 66.5,14.07 U$14.P$8 | v8.69,56.57 8.69,50.65 v7.54,49.89
  Bottom 1.27: U$14.P$8 U$14.P$4 | J3.2 71.12,3.81 | 71.78,11.33 73.2,11.33 73.66,10.87 73.66,3.81 73.66,1.02 51.03,1.02 | 51.03,1.02 36.2,1.02 | 36.2,1.02 30.79,1.02 30.43,1.37 v30.43,11.2 | TP1.TP 51.03,4.93 51.03,1.02 | 36.2,3.38 36.2,1.02 | 40.44,25.04 40.44,8.23 36.37,4.17 Q2.S | 40.18,25.32 v40.18,25.78 40.18,30.02 v38.84,30.07 | C12.+ v20.32,57.96 v26.75,57.91 | 26.75,57.89 v26.75,57.91 | v26.75,57.91 27.64,57.4 28.22,57.02 28.22,37.16 28.17,37.16 25.88,34.87 v25.88,30.12 | 40.18,30.05 38.84,30.05
  other vias: 24.94,57.96 25.88,31.88 40.13,30.07
  pour Top: 24.13,57.15 27.28,57.15 27.28,58.42 24.13,58.42
AGND  (via drill 0.6)
  Top 0.254: U1.37 19.23,21.64 17.73,21.64 | 17.73,21.64 17.23,21.64 | 17.23,21.64 14.22,21.64 U1.47 14.22,23.39 13.54,23.93 12.95,24.26 13.21,24.13 10.77,24.31 10.72,24.26 JP4.2 | U1.40 17.73,21.64 | U1.41 17.23,21.64
  Top 0.406: JP4.2 9.75,25.04 9.68,25.12 8.61,25.12 C22.2 | U$13.2 22.73,45.97 | 22.73,45.97 22.73,48.24 C16.2 | C15.C 25.12,45.08 24.21,45.97 22.73,45.97 | U$12.2 22.61,51.84 | 22.61,51.84 22.61,54.09 C48.2 | C14.C 24.67,51.3 24.26,51.69 22.73,51.69 22.61,51.84 | C11.2 17.64,32.25 17.78,32.38 17.78,32.36 17.93,32.21 17.93,30.81 17.88,30.63 17.88,30.33 17.35,29.29 17.35,28.61 C29.2 | 19.33,47.8 14.91,47.8 14.91,51.83 R7.2 13.8,51.79 13.31,51.79 12.88,51.36 12.88,50.93 12.48,50.53 R31.2 | 18.69,45.01 21.36,45.64 21.69,45.97 22.73,45.97 | C42.2 12.59,36.46 | C40.2 11.09,33.53 12.65,33.53 13.51,34.39 13.51,34.54 13.79,34.82 | JMP4.1 1.6,45.09 v1.63,45.11 | C30.2 12.8,28.55 12.88,28.63 13.88,28.63 C31.2
  Top 0.61: C22.2 7.66,26 7.62,26.04 7.62,29.01 7.64,29.03 C35.2 | C20.2 21.54,27.25 21.69,27.41 21.69,30.33 | 21.69,30.33 21.69,33.4 21.31,33.68 16.99,33.68 C11.2 | C21.2 20.56,30.33 21.69,30.33
  Bottom 0.406: v1.63,45.11 1.63,45.67
  other vias: 6.22,47.47 6.05,41.5 7.42,51.51 14.07,45.8 15.04,49.78 18.54,51.41 20.29,51.38 19.58,48.44 20.83,44.37 13.67,34.52 11.61,29.9 16.48,33.96 1.68,29.9 4.29,36.65 19.41,39.7 19.41,35.43 10.59,42.67 9.37,42.67 12.83,45.8 15.34,46.69 24.16,51.69 24.41,46.48 11.3,24.16 11.89,26.37 19.79,24.97 19.79,23.9 6.12,34.42 6.25,48.64 9.25,44.2 1.04,40.51
  pour Top: 0.64,27.94 8.26,27.94 8.26,24.77 10.82,24.77 10.82,23.7 13.49,23.7 13.49,23.5 14.17,23.5 14.17,21.31 19.58,21.31 19.58,21.84 20.85,21.84 20.85,32.36 19.79,32.36 19.79,52.83 0.64,52.83
  pour Top: 19.68,55.88 27.3,55.88 27.3,43.81 19.68,43.81
  pour Bottom: 0.64,52.07 26.67,52.07 26.67,42.55 20.32,42.55 20.32,29.21 0.64,29.21
  pour Bottom: 9.5,29.18 9.53,22.23 20.32,22.23 20.29,29.18
AVDD  (via drill 0.6, 0.7)
  Top 0.254: U1.45 15.23,23.9 15.24,23.9 13.99,25.12 13.99,25.45 | U1.43 16.23,25.7 v15.88,26.11 15.82,26.11 | U1.38 18.73,25.28 18.26,25.7 v17.73,25.7
  Top 0.406: v15.88,26.11 13.95,26.11 C31.1 C30.1 12.8,25.45 13.99,25.45 | C15.A 25.78,49.15 21.74,49.15 21.44,48.84 21.44,48.27 C16.1 21.44,48.25 | 21.44,47.47 22.08,46.83 U$13.5 21.64,47.24 21.18,46.79 v21.11,46.74 | C29.1 17.37,26.06 v17.73,25.7
  Top 0.61: 21.44,47.47 21.44,48.25
  Top 1.016: TP5.TP 20.95,46.58 v21.11,46.74
  Bottom 0.406: v17.73,25.7 17.35,26.11 v15.88,26.11
  Bottom 0.61: v21.11,46.74 23.04,44.86 23.04,38.94 21.51,37.26 21.51,27.18 18.67,27.18 17.73,26.24 v17.73,25.7
BAT+5V  (via drill 0.7, 1.1)
  Top 0.406: U$12.1 21.96,50.04 23.27,50.04 U$12.3 23.26,50.09 24.13,50.09 v24.16,50.16 | U$13.3 23.39,45.15 23.39,44.32 22.08,44.32 U$13.1 22.08,44.37 22.17,44.37 22.17,44.32 v24.18,44.02 | U$16.1 22.01,34.54 23.32,34.54 U$16.3 23.31,34.57 v24.18,34.57
  Top 0.813: U$9.2 74.25,35.02 74.78,34.49 74.78,33.43 | 74.78,33.43 74.78,30.25 74.24,29.72 U$14.P$1 | D1.C 74.73,33.48 74.78,33.43
  Top 1.016: U$14.P$5 69.22,30.48 69.22,30.73 68.25,31.7 68.25,33.09 C4.2
  Top 1.27: C4.2 68.26,31.43 69.22,30.48 69.22,27.81 v24.13,27.81
  Bottom 0.61: v24.16,50.16 26.52,50.16 26.52,43.48
  Bottom 0.813: 26.52,43.99 v24.18,44.02
  Bottom 1.016: v24.13,27.81 v24.18,34.57 24.18,35.59 26.54,37.95 26.54,41.63 26.52,41.66 26.52,43.48 26.52,43.99
  Bottom 1.27: 69.24,29.69 U$14.P$5 U$14.P$1
CPVDD  (via drill 0.6)  (2 unrouted)
  Top 0.406: 21.32,52.62 C48.1 21.34,54.12 21.34,54.66 21.68,55 21.82,55.14 23.75,55.14 24.79,54.1 C14.A | 21.32,52.62 21.41,52.53 21.94,52.53 U$12.5 | U$5.8 11.73,41.13 11.73,39.47 12.34,38.86 12.34,38.02 12.37,38 13.16,38 13.66,37.49 v13.99,37.49 | U$5.1 7.3,43.34 6.96,43.69 v6.07,43.69 | TP7.TP 21.08,52.86 21.32,52.62
  Top 0.61: C43.1 4.7,43.69 v6.07,43.69 | v20.4,54.99 20.47,55 21.68,55
  Bottom 0.406: 13.87,47.7 16.2,47.68 16.36,47.52 16.61,47.52 17.14,46.99 17.14,40.23 14.94,38.02 14.53,38.02 v13.99,37.49
  Bottom 0.61: v20.4,54.99 13.87,55.02 13.87,47.7 7.98,47.68 6.07,45.77 v6.07,43.69
CVDD  (via drill 0.6)  (2 unrouted)
  Top 0.254: 11.12,19.33 11.39,19.14 U1.5 | U1.7 11.38,18.14 | 19.84,18.64 U1.31 23.11,18.64 23.29,18.82 | U1.24 19.73,14.14 19.74,14.15
  Top 0.305: 11.38,18.14 10.9,18.14 v10.62,17.86
  Top 0.406: C28.1 9.67,20.32 9.53,20.32 v9.53,21.59 | 11.12,19.33 10.13,20.32 | 23.8,19.2 23.88,19.28 | C25.1 23.88,19.28 | 21.35,37.02 U$16.5 | 21.36,37.02 C24.1 21.37,39.42 24.97,39.42 25.15,39.6 | C27.1 10.16,17.4 v10.62,17.86 | v15.65,18.64 19.63,18.64 | 19.63,18.64 19.84,18.64 | 19.74,14.15 20.19,14.15 | 20.19,14.15 21.27,14.15 C26.1 | 23.29,18.82 23.75,19.28 23.88,19.28 | 20.19,14.15 19.96,14.38 19.96,14.86 19.63,15.19 19.63,18.64 | C23.A 26.09,39.42 25.91,39.6 25.15,39.6 | 25.15,39.6 v25.09,39.6 23.7,39.6 TP6.TP
  Bottom 0.406: v10.62,17.86 11.89,17.86 11.89,19.74 | 11.89,19.74 14.55,19.74 v15.65,18.64 | v9.53,21.59 9.98,22.05 11.35,22.05 11.89,21.51 11.89,19.74
  Bottom 0.61: v15.65,18.64 15.65,20.02 17.45,21.82 20.78,21.82 22.48,23.72 22.53,36.93 v25.09,39.6
GBUF
  Top 0.254: U1.42 16.73,26.48 R20.2
  Top 0.406: R20.2 15.05,27.29 15.01,27.25 15.01,29.41 14.73,29.69 13.99,29.69 12.34,31.34 7.9,31.34 7.8,31.24 5.51,31.24 5.16,30.89 3.17,30.89 2.03,32.03 2.03,41.71 JMP4.3
GND  (via drill 0.6, 0.7)  (1 unrouted)
  Top 0.254: U1.16 15.23,15.23 15.24,15.24 v15.24,15.88 | U1.22 18.23,15.19 17.73,15.19 | 17.73,15.19 17.23,15.19 | U1.20 17.23,15.19 | 17.23,15.19 17.23,15.85 v17.25,15.85 | U1.4 13.11,19.63 13.16,19.68 v19.05,19.68 19.05,20.3 19.38,20.62 20.7,20.62 U1.35 | 18.55,20.23 18.55,20.18 | U1.21 17.73,15.19 | 17.73,15.19 | 17.73,15.19 U1.21
  Top 0.406: 11.2,11.1 11.64,11.54 | v53.85,44.42 53.98,44.76 53.98,34.36 U$10.P$11 | U$4.6 53.17,24.47 53.57,24.87 v55.24,24.87 | C34.2 30.05,20.42 30.28,20.19 v30.28,19.61 | R3.1 36.63,24.75 36.63,23.55 35.41,22.33 v34.59,20.88 | v19.05,19.68 18.55,20.18 18.41,20.32 13.34,20.32 13.34,21.59 12.34,22.58 9.75,22.58 JP4.1 | 51.08,33.2 51.08,33.15 v51.05,34.06 51.13,34.19 | C7.1 51.13,34.27 51.13,34.19 | U$6.4 46.1,36.63 48.46,34.27 51.05,34.27 51.13,34.19 | C24.2 22.66,38.35 22.66,36.2 | 22.66,36.2 U$16.2 | 22.66,36.2 25.19,36.2 C23.C | 8.2,46.05 8.2,46.61 7.95,46.86 U$5.19 | C26.2 23.88,14.12 23.88,14.45 | U$3.38 48.9,60.15 arc90 v47.5,58.75
  Top 0.508: 11.64,11.54 C32.2
  Top 0.61: U$3.38 52.1,60.15 53.21,61.27 C2.2 | JP4.1 8.22,23.44 8.2,23.42 8.2,22.28 8.33,22.15 8.33,20.3 C28.2 C33.2 8.34,18.32 8.26,18.24 8.26,17.39 C27.2 | R2.1 4.64,24.43 5.71,24.43 | C17.1 18.77,5.73 18.77,4.24 14.43,4.24 14.41,4.61 C18.1 14.39,5.71 13.97,5.71 12.32,7.37 12.32,9.25 11.2,10.36 11.2,11.1 | R34.1 5.5,9.58 6.2,9.58 6.22,9.55 6.22,8.33 6.02,8.13 1.14,8.13 | R39.2 R37.1 R22.2 30.79,3.8 30.79,1.02 | S1.1 53.98,3.4 53.98,1.02 | Q1.3 39.24,3.35 | C13.1 71.78,22.2 69.65,20.07 69.65,13.21 | J3.6 64.77,1.02 | 63.25,11.35 63.3,11.3 C5.1 | 28.32,40.79 v15.32,40.79 | v8.23,46.02 8.2,46.05 | C8.2 6.2,52.22 6.35,52.38 6.35,54.89 6.81,55.35 13.51,55.35 14.78,56.62 v17.42,56.62 | U$8.P$2 27.91,66.02 27.89,66.04 21.59,66.04 C12.- | 28.17,40.82 28.17,38.51 28.07,38.41 28.07,35.28 28.05,35.3 C23.C
  Top 0.813: U$3.38 U$3.1 30.5,60.15 30.36,60.01 C9.2
  Top 1.016: 27.86,59.99 27.87,60.01 C9.2
  Top 1.27: U$14.P$7 63.25,11.35 | 63.25,11.35 64.66,11.35 C5.1 | 63.25,11.35 63.25,13.21 69.65,13.21 74.93,13.21 74.93,1.02 64.77,1.02 53.98,1.02 30.79,1.02 1.14,1.02 1.14,8.13 1.14,26.04 5.71,26.04 5.71,24.43 6.73,23.42 8.2,23.42 | v22.71,61.8 22.73,61.82 25.86,61.82 27.69,59.99 27.86,59.99
  Bottom 0.254: v15.24,15.88 17.25,15.88 v17.25,15.85
  Bottom 0.406: 52.3,34.36 52.3,34.37 U$10.P$11 52.3,34.36 | 52.3,33.55 52.3,33.56 U$10.P$12 | U$10.P$12 52.3,33.55 | 52.3,33.55 52.3,33.17 | 52.3,33.17 52.3,32.77 | 52.3,32.77 52.3,32.76 U$10.P$13 52.3,32.77 | 52.3,32.77 52.3,31.95 52.3,31.96 U$10.P$14 | U$10.P$1 56.94,42.36 57.68,43.1 57.68,44.65 56.87,45.41 v53.85,44.42 | U$10.P$8 57.1,36.75 57.25,36.91 58.01,36.91 59.21,35.71 59.21,34.09 58.67,33.55 U$10.P$12 | v55.24,24.87 55.24,24.77 | v30.28,19.61 30.43,19.61 | v34.59,20.88 34.75,21.03 35.56,22.23 | 52.3,34.36 52.3,33.55 | 52.3,33.17 51.13,33.17 v51.05,34.06
  Bottom 0.61: v8.23,46.02 8.23,40.34 8.56,40.01 14.78,40.03 v15.32,40.79 | v17.42,56.62 18.06,57.25 18.06,65.68 19.68,67.31 C12.-
  Bottom 1.27: U$14.P$3 U$14.P$7 | 20.9,67.31 20.9,66.73 22.71,64.92 v22.71,61.8
  other vias: 17.14,19.68 23.95,25.07 31.75,32.38 37.47,56.52 45.62,56.16 51.33,7.9 69.75,14.25 71.02,25.65 42.7,7.72 47.22,51.94 45.21,49.83 34.87,44.22 35.18,47.24 26.11,14.53 23.93,14.5 1.42,24.87 1.27,10.79 8.08,22.5 11.56,9.35 21.01,8.43 26.14,7.9 36.4,19.41 34.67,19.33 35.81,20.9 35.94,23.47 33.68,34.29 34.14,37.41 51.13,32.31 49.4,29.39 53.87,46.13 68.2,17.27 70.92,17.32 68.1,25.68 61.21,26.14 61.29,19.91 55.37,19.84 45.09,13.36 42.01,14.02 57.4,8.28 16.28,8.66 38.63,13.79 34.82,10.41 34.85,7.57 32.51,4.62 32.51,5.97 28.91,2.01 26.92,2.03 1.27,1.27 5.94,23.75 1.37,23.5 1.3,2.49 2.46,1.27 6.93,9.22 3.56,6.4 36.2,26.24 32,26.37 34.14,26.37 57.89,32.49
  pour Bottom: 75.56,0.23 75.56,27.3 57.15,27.3 57.15,31.75 58.42,31.75 58.42,47.62 56.52,47.62 56.52,56.52 53.34,56.52 53.34,59.05 28.57,59.05 28.63,40.67 21.87,40.56 21.69,40.59 21.59,34.29 21.59,20.95 8.26,20.95 8.26,27.94 0.56,27.89 0.56,0.18
  pour Top: 74.93,0.64 0.64,0.64 1.27,26.04 7.62,26.04 7.59,22.86 12.7,22.86 12.73,20.55 74.96,20.32
  pour Bottom: 74.93,20.32 74.93,27.94 57.15,27.94 57.15,31.11 59.05,31.11 59.05,51.44 27.94,52.07 27.94,20.32
  pour Top: 27.94,34.29 27.94,59.69 56.52,59.69 56.52,34.29
LCD_RST  (via drill 0.6)
  Top 0.406: v57.63,41.58 57.15,41.58 57.15,38.1 v64.85,38.1 | SJ3.1 73.03,27.53 v73.69,28.19
  Bottom 0.406: U$10.P$2 57.82,41.56 v57.63,41.58 | v64.85,38.1 68.02,34.92 73.66,34.92 73.69,34.9 v73.69,28.19
LED  (via drill 0.6)
  Top 0.406: R14.2 33.12,11.51 33.17,11.56 v46.58,11.56
  Bottom 0.406: U$10.P$10 54.81,35.18 49.73,35.18 49.58,35.03 49.58,31.29 47.83,29.54 47.83,22.73 46.56,21.46 46.56,11.58 v46.58,11.56
LEFT
  Top 0.254: 14.15,24.18 14.73,23.7 U1.46
  Top 0.406: R32.2 10.02,26.01 10.95,26.01 | 10.95,26.01 10.97,26.04 10.97,29.03 10.96,29.04 R28.2 | 14.15,24.18 13.41,24.82 11.96,24.79 11.56,25.2 11.23,25.2 10.95,25.48 10.95,26.01
N$1
  Top 0.406: Q2.G 35.15,5.41 35.15,2.49 35.41,2.23 40.82,2.23 41.88,3.3 Q1.1 42.24,3.81 R15.2
N$2
  Top 0.406: R14.1 33.83,6.51 Q2.D
N$3
  Top 0.305: U$5.16 9.84,48.76 9.86,48.77
  Top 0.406: 9.86,48.77 9.86,50.48 R8.1
N$4
  Top 0.406: Q1.2 41.6,6.35 R16.2
N$5
  Top 0.254: U1.9 11.18,17.14 10.08,16.48
  Top 0.406: 10.08,16.48 7.19,16.48 7.19,21.51 6.15,22.48 SJ7.2
N$6
  Bottom 0.406: LED1.A 2.26,68.68 1.78,68.2 1.78,67.32 | 1.78,67.32 LED2.A | 1.78,67.32 1.78,66.29 1.91,66.17 1.91,65.29 R4.1
N$7
  Top 1.27: C3.2 67.44,68.58 67.56,68.45 U$15.P$5
  Bottom 1.27: U$15.P$1 U$15.P$5 69.22,71.12 9.3,71.12 7.72,69.55 J1.GND
N$8  (via drill 0.6)
  Top 0.406: v7.11,71.12 9.4,71.12 v10.62,69.75
  Bottom 0.406: LED2.C 4.06,67.31 5.36,68.61 LED1.C 5.84,69.85 v7.11,71.12 | U$7.1 55.83,64.67 55.85,66.04 52.86,66.04 52.83,60.96 52.7,60.83 27.3,60.83 26.04,62.1 26.04,69.09 25.02,69.98 24.99,69.95 11.58,69.95 11.38,69.75 v10.62,69.75
N$9
  Bottom 0.508: U$7.5 56.28,67.34 56.29,67.33
  Bottom 0.61: 58.89,65.81 R1.2
  Bottom 0.813: 56.29,67.33 57.35,67.33 58.6,66.09 58.89,65.81
N$10
  Top 0.406: R23.2 73,20.28 C13.2 73.65,20.31 74.3,20.95 74.3,24.13 74.27,24.13 74.02,24.38 73.05,24.38 SJ3.2
N$11
  Top 0.254: U1.33 22.17,19.63 22.43,19.89 22.43,20.02
  Top 0.406: 22.43,20.02 25.25,22.84 26.42,22.84 27.66,21.59 30.48,21.59 30.48,20.95 30.58,20.85 31.52,20.85 31.62,20.75 SJ1.1
N$12
  Top 0.254: U1.34 21.59,20.14 22.15,20.7
  Top 0.406: 22.15,20.7 24.99,23.55 26.92,23.55 28.25,22.23 SJ2.1
N$13
  Top 0.305: U$5.18 8.57,48.55 8.59,48.56
  Top 0.406: 8.59,48.56 8.59,49.84 C39.1
N$14
  Top 0.305: U$5.12 12.38,48.68 12.55,48.84
  Top 0.406: 12.55,48.84 12.85,48.84 13.84,49.84 R7.1
N$15
  Top 0.254: U1.36 21.51,21.13 21.69,21.31
  Top 0.406: 21.69,21.31 24.66,24.28 30.25,24.28 30.73,24.77 SJ5.1
N$16  (via drill 0.6)
  Top 0.406: SJ1.2 SJ2.2 SJ5.2 34.29,24.77 | 34.29,24.77 R3.2 | SJ6.2 34.14,13.79 v35.53,13.82 | v34.37,23.6 34.29,23.67 34.29,24.77
  Bottom 0.406: v35.53,13.82 33.15,13.82 33.15,22.86 33.88,23.6 v34.37,23.6
N$17
  Top 0.406: R16.1 47.94,5.08 JMP3.2
N$18  (via drill 0.6)
  Top 0.406: C21.1 R29.1 v19.41,32.66
  Bottom 0.406: v19.41,32.66 19.41,33.93 C36.-
N$19
  Bottom 0.508: U$11.4 68.72,63.74 69.06,64.08 69.06,65.18 72.97,65.18 72.97,63.87 R18.1
  Bottom 0.61: R17.2 70.44,64.08 69.06,64.08
N$20
  Bottom 0.508: 63.86,63.73 63.87,63.74 U$11.3
  Bottom 0.61: R21.2 R19.2 64.71,67.46 64.11,67.46 63.37,66.95 63.37,64.01 63.65,63.73 63.86,63.73
N$21
  Top 0.406: R28.1 C35.1 8.6,30.35 7.21,30.35 6.48,29.62 C37.-
N$22  (2 unrouted)
  Top 0.254: U1.18 16.23,12.6
  Top 0.406: 16.23,12.6 16.64,12.19 16.64,11.92 R27.2 17.2,11.91 18.87,8.69 | C17.2 17.46,6.24 18.87,8.66
N$23
  Top 0.406: J5.P$5 12.19,53.47 12.7,54.08 16.51,54.08 17.35,53.14 17.35,51.79 16.87,51.31 JMP1.2
  Bottom 0.813: J5.P$1 J5.P$5
N$24  (2 unrouted)
  Top 0.254: U1.17 15.72,14.13 15.72,13.23 15.39,12.9
  Top 0.305: 15.39,12.83 15.39,12.9
  Top 0.406: 15.39,12.83 15.33,12.76 R27.1 14.58,11.91 13.92,8.71 | C18.2 13.93,8.67
N$25  (via drill 0.6)
  Top 0.254: U1.44 15.75,22.65 15.75,24.51 v15.34,25.02 | v14.48,30.94 15.12,30.95 C19.2
  Bottom 0.254: v15.34,25.02 14.48,25.02 v14.48,30.94
N$26
  Top 0.406: C22.1 R32.1
N$27  (via drill 0.7)
  Top 0.406: v2.54,52.05 2.23,51.74 2.23,49.45 2.36,49.33 JMP2.2
  Top 0.813: v2.54,56.52 6.22,56.52 J5.P$2
  Bottom 0.406: v2.54,52.05 v2.54,56.52
N$28
  Top 0.406: R30.1 C20.1
N$29
  Top 0.406: R20.1 16.08,29.36 16.13,29.41 16.43,29.41 16.76,29.74 16.76,30.72 C11.1
N$30  (via drill 0.6, 0.7)
  Top 0.406: R33.2 3.91,50.56 | 3.91,50.56 3.37,50.56 JMP2.3 | C37.+ 4.04,32.16 2.67,33.53 2.67,46.48 1.98,47.17 v1.98,47.19 | v3.99,51.66 3.99,50.64 3.91,50.56
  Bottom 0.406: v1.98,47.19 2.03,47.24 2.03,49.55 3.99,51.51 v3.99,51.66
N$31  (via drill 0.6)
  Top 0.406: JMP1.3 15.65,52.91 | 15.65,52.91 15.45,53.11 14.94,52.68 12.95,52.68 12.65,52.38 12.62,52.36 R31.1 | v15.44,53.14 15.65,52.91
  Bottom 0.406: v15.44,53.14 15.44,51.69 18.41,48.72 18.41,39.37 17.78,38.73 C36.+
N$32
  Top 0.61: D3.A U$15.P$8
  Bottom 1.27: U$15.P$8 U$15.P$4
N$33
  Top 0.254: U1.25 21.82,15.64 21.95,15.52
  Top 0.406: 21.95,15.52 27.64,15.52 28.96,14.2 32.31,14.2 32.69,13.82 SJ6.1 32.72,13.74
N$34
  Top 0.254: U1.12 11.66,15.65 10.64,14.61
  Top 0.406: 10.64,14.61 5.16,14.61 4.78,14.81 SJ10.2
N$35
  Top 0.406: R25.2 41.43,24.47 U$4.11
N$36
  Top 0.254: 10.39,15.24 11.48,16.13 U1.11
  Top 0.406: SJ9.2 5.92,17.4 5.92,15.24 10.39,15.24
N$37
  Top 0.254: U1.10 11.25,16.64 10.16,15.88
  Top 0.406: 10.16,15.88 6.55,15.88 6.55,19.94 SJ8.2
N$38  (via drill 0.6)
  Top 0.406: U$5.10 13.02,39.92 v13.79,38.81 | v15.32,45.01 16.73,45.01 R9.2
  Bottom 0.406: 15.62,44.7 v15.32,45.01 16.51,43.81 16.51,40.49 14.83,38.81 v13.79,38.81
N$39
  Top 0.406: U$5.7 11.1,41.13 11.1,39.06 11.07,39.04 R10.2
N$40
  Top 0.406: U$5.6 10.49,41.14 10.49,39.8 9.8,39.12 R38.2
N$41
  Top 0.406: U$5.5 9.83,41.13 9.83,40.03 8.26,38.46 C45.2
N$42
  Top 0.406: U$5.2 7.92,41.13 7.92,40.01 6.6,38.68 5.99,38.68 5.59,38.28 C44.2
N$43
  Top 0.406: U$5.4 9.2,41.13 9.2,40.34 6.99,38.12 6.99,36.68 6.29,35.98 C44.1
N$44
  Top 0.406: 4.7,53.34 J5.P$4 4.8,53.44 0.71,53.44 0.71,42.67 JMP4.2
  Bottom 0.813: J5.P$4 J5.P$3
N$45
  Top 0.406: SJ10.1 SJ9.1 SJ8.1 SJ7.1 3.29,22.59 R2.2
N$46  (via drill 0.6)
  Top 0.61: v70.94,58.93 D4.A
  Bottom 0.406: J4.VBUS 70.94,57.18 70.94,57.48
  Bottom 1.016: 70.94,57.48 v70.94,58.93
  other vias: 70.94,57.86
  pour Top: 70.41,59.69 70.41,57.56 71.48,57.56 71.48,59.69
N$47  (via drill 0.6)
  Top 0.406: v6.81,4.47 8.43,2.85 19.96,2.85 22.2,5.08 23.57,5.08 23.84,5.37 R36.1
  Bottom 0.406: S2.B 5.41,5.05 6.22,5.05 v6.81,4.47
N$50  (via drill 0.6)
  Top 0.406: R26.1 22.43,3.81 v21.69,3.07
  Bottom 0.406: S2.D 7.57,0.79 21.69,0.79 v21.69,3.07
PCM_L  (via drill 0.7)
  Top 0.406: C41.1 | JMP1.1 v16.26,49.05 | R38.1 C41.1 | C41.1 9.78,34.82 9.12,34.82 8.41,34.11 v8.05,34.11
  Bottom 0.406: v8.05,34.11 9.83,35.89 14.94,35.89 16.26,37.21 16.26,38.38 17.78,39.9 17.78,47.62 17.2,48.21 17.09,48.21 v16.26,49.05
PCM_R  (via drill 0.7)
  Top 0.406: R10.1 11.07,35.76 | 11.07,35.76 12.32,35.76 v12.32,34.85 | v4.14,34.85 3.3,35.69 3.3,40.92 3.5,41.07 3.5,47.07 3.07,47.45 JMP2.1 | 11.07,35.76 C40.1
  Bottom 0.406: v12.32,34.85 10.59,33.15 5.23,33.15 4.14,34.21 v4.14,34.85
RESET  (via drill 0.6)
  Top 0.406: v53.95,15.11 v37.49,15.11 | U$3.3 31.69,57.66 34.09,57.66 34.34,57.4 v34.31,56.77
  Bottom 0.406: S1.3 53.98,8.03 v53.95,15.11 | 34.31,56.82 v34.31,56.77 36.25,54.84 40.01,51.05 40.01,43.18 39.37,42.55 39.37,32.66 39.12,32.41 37.49,32.41 36.17,31.09 36.17,28.88 37.39,27.69 37.39,22.96 36.78,22.35 36.78,21.29 37.47,20.6 37.47,20.32 37.49,20.3 v37.49,15.11
  Bottom 0.61: S1.3 55.65,6.35 J3.5
RIGHT  (via drill 0.6)
  Top 0.254: U1.39 18.23,23.75 v17.65,24.23
  Top 0.406: v19.41,26.16 R30.2 18.41,27.27 18.41,29.84 18.87,30.3 19.39,30.3 R29.2 19.41,30.33
  Bottom 0.406: v17.65,24.23 19.41,25.98 v19.41,26.16
RX  (via drill 0.6)  (21 unrouted)
  Top 0.406: v69.85,8.26 69.83,8.89 v62.61,9.12 | U$3.34 49.66,55.09 v51.66,55.09 | v53.82,55.09 54.08,54.84 54.08,49.38 54.86,48.54 54.86,36.17 55.22,35.87 61.54,35.87 62.18,35.23 v62.18,34.42
  Bottom 0.406: v51.66,55.09 v53.82,55.09 | v62.18,34.42 62.69,33.91 62.69,29.23 62.56,29.11 62.56,9.07
  Bottom 0.813: J3.1 v69.85,8.26
  other vias: 36.88,13.72
RX_A  (via drill 0.6)  (1 unrouted)
  Top 0.406: R24.1 36.83,8.4 v36.83,10.79 36.83,15.24 29.21,15.24 27.94,16.51 22.23,16.51 22.23,15.88
SD0  (via drill 0.6)
  Top 0.406: U$3.21 42.55,38.56 | 42.55,38.56 U$3.45 | v42.09,38.56 42.55,38.56 | U$6.2 v41.71,34.09
  Bottom 0.406: v42.09,38.56 42.09,34.47 v41.71,34.09
SD1  (via drill 0.6)
  Top 0.406: v38.56,43.87 43.41,43.87 43.79,43.48 43.79,42.18 U$3.22 43.81,40.01 44.6,39.22 48.03,39.22 48.62,39.8 49.61,39.8 U$3.46 | U$6.5 38.33,37.13 37.82,37.64 v37.59,37.64
  Bottom 0.406: v38.56,43.87 38.1,43.41 38.1,39.06 37.59,38.56 v37.59,37.64
SD2  (via drill 0.6)
  Top 0.406: U$3.41 36.15,39.83 | U$3.17 37.47,40.82 36.48,39.83 36.15,39.83 | U$6.7 v35.46,34.09 | 36.15,39.83 v36.09,39.78
  Bottom 0.406: 36.07,39.83 36.04,39.83 v36.09,39.78 36.09,39.8 35.46,39.17 v35.46,34.09
SD3
  Top 0.406: U$3.42 38.74,38.56 | 38.74,38.56 38.73,40.72 U$3.18 | U$6.3 42.11,35.36 41.91,35.56 41.88,35.56 41.45,35.99 41.45,37.64 40.51,38.58 38.76,38.58 38.74,38.56
STAB-5V  (via drill 0.6)  (2 unrouted)
  Top 0.61: 67.11,56.52 v67.11,56.63 D4.C v67.11,56.63 v67.11,56.64 | 67.11,54.48 69.21,54.48 D3.C
  Top 1.27: 67.11,56.52 67.11,54.48
  Bottom 0.508: U$11.5 70.13,61.84 70.54,61.84 R17.1
  Bottom 0.813: 68.63,61.82 70.11,61.82 70.13,61.84
  Bottom 1.27: 68.63,61.82 68.63,59.79 67.11,59.79 v67.11,56.64 67.11,48.03 71.07,48.03 | C6.+ 72.29,47.9 71.07,47.83 71.07,48.03 | TP2.TP 71.07,48.03
  other vias: 67.11,55.52 67.11,54.43
TX  (via drill 0.6)
  Top 0.406: v62.87,2.95 v62.87,7.62 | U$3.35 v51.18,56.34 | v54.84,56.36 54.81,56.34 54.81,49.86 55.5,49.17 55.5,36.7 55.63,36.58 62.79,36.58 63.48,35.89 v63.48,35.53
  Bottom 0.406: 67.31,2.54 67.26,2.36 63.45,2.36 v62.87,2.95 | v62.87,7.62 63.5,8.26 63.5,35.51 v63.48,35.53 | v51.18,56.34 51.84,56.36 v54.84,56.36
  Bottom 0.61: J3.4 67.31,2.54
V-  (via drill 0.6, 1 pad 1.78, 1.1)  (1 unrouted)
  Top 0.61: 66.67,41.94 R6.2 66.65,33.58 66.36,33.58 C4.1
  Top 0.813: 63.8,66.02 63.82,66.03 63.82,66.27 | 63.82,66.27 C3.1 | v74.02,66.27 v72.97,66.27 v71.93,66.27 63.82,66.27
  Top 1.016: 66.04,42.18 J2.1 61.2,42.18 61.19,42.16 v61.19,44.32 | 66.04,42.18 67.93,42.18 | 66.67,41.94 66.04,42.18 | 63.8,66.02 58.62,66.02 58.6,65.99 v58.6,64.16
  Top 1.27: J1.PWR 13.72,66.67 13.72,71.12 58.62,71.12 U$15.P$2 | U$15.P$2 U$15.P$6 62.48,68.45 62.48,68.58 C3.1 | U$15.P$2 U$15.P$3 | 67.93,42.18 69.34,40.77 C6.-
  Bottom 0.406: U$7.2 54.86,63.86 55.04,63.7 57.2,63.7 57.53,63.35 | R1.1 58.64,64.48 58.62,64.14 | J4.GND 70.79,54.58
  Bottom 0.508: U$11.2 66.09,62.79
  Bottom 0.61: 66.09,62.79 66.09,64.41 66.12,64.41 66.4,64.69 66.75,64.69 66.98,64.92 R21.1 R19.1 | 65.01,66.19 68.35,66.19 | R1.1 58.49,64.45
  Bottom 0.813: R18.2 72.95,61.98 75.01,61.98 | 75.29,61.98 75.01,61.98 | 75.01,61.98 75.23,62 75.23,66.27 75.16,66.27 v74.02,66.27 68.53,66.27 68.35,66.19 | 70.79,54.58 70.79,51.99 75.23,51.99
  Bottom 1.016: 58.49,64.45 v58.6,64.16 58.57,64.14 58.32,64.14 57.53,63.35 57.53,61.48 C1.1 | 75.23,51.99 J4.SHIELD2 J4.SHIELD3 J4.SHIELD1 75.23,62 | v74.93,68.58 74.93,67.77 75.23,67.46 75.23,66.34 75.16,66.27
  Bottom 1.27: U$15.P$3 U$15.P$7 v61.19,44.32 v61.19,42.29 61.19,35.74 60.76,35.31 60.76,30.15 U$14.P$6 | U$14.P$2 U$14.P$6 | U$14.P$6 59.89,29.72
V_BATT  (via drill 1.1)
  Top 0.813: U$9.3 72.44,38.02 72.77,38.35
  Top 1.016: 63.4,44.18 J2.2 68.89,44.17 69.85,43.2 74.88,43.2 75.82,42.27 75.79,38.35 72.77,38.35
  Top 1.27: v63.4,46 63.4,44.18
  Bottom 0.508: U$7.3 53.92,64.73 53.92,63.86
  Bottom 0.813: 53.92,63.86 53.92,62.71 55.55,62.71 55.55,61.27 C1.2
  Bottom 1.27: 55.55,61.27 55.55,58.55 63.35,58.55 63.35,45.8 v63.4,46
X+  (via drill 0.6)
  Top 0.406: v51.71,21.46 51.31,21.87 U$4.2
  Bottom 0.406: U$10.P$15 52.07,31.17 50.7,29.79 50.7,27.38 51.28,26.8 51.28,21.92 51.71,21.49 v51.71,21.46
X-  (via drill 0.6)
  Top 0.406: v53.42,22.68 52.98,23.16 49.53,23.16 49.45,23.16 U$4.4
  Bottom 0.406: U$10.P$17 52.68,29.57 52.25,29.13 52.25,28.37 52.93,27.69 52.91,27.66 52.88,23.24 53.39,22.73 v53.42,22.68
XRESET  (via drill 0.6)
  Top 0.254: 10.87,20.65 11.38,20.14 11.51,20.14 U1.3
  Top 0.406: R34.2 4.06,9.66 SJ4.2 4.06,13.39 7.98,13.39 D2.3 8.97,12.61 v8.97,13.66 | v10.87,20.9 10.87,20.65
  Bottom 0.406: v8.97,13.66 8.97,18.29 9.5,18.82 10.85,18.82 10.87,18.85 v10.87,20.9
Y+  (via drill 0.6)
  Top 0.406: U$4.3 52.05,22.53 53.06,21.51 v53.06,21.29
  Bottom 0.406: U$10.P$16 52.64,30.36 52.63,30.35 52.58,30.35 51.44,29.21 51.44,27.94 52.07,27.3 52.07,22.53 53.06,21.54 v53.06,21.29
Y-  (via drill 0.6)
  Top 0.406: U$4.5 v54,23.82
  Bottom 0.406: U$10.P$18 54.01,27.94 v54,23.82

## Text on the board
Top: Designed by / RSH 2019
tNames: -V | STAB 5V | +3V3
bNames: 5V